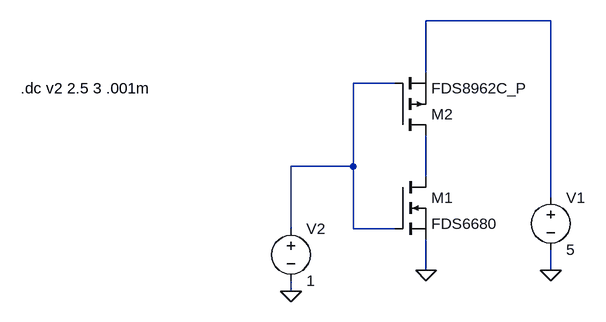
[diagram p0: schematic mos1.asc]
mos1.asc, the LTspice schematic file:
Version 4
SHEET 1 880 680
WIRE 384 -96 192 -96
WIRE 192 -16 192 -96
WIRE 144 0 80 0
WIRE 80 128 80 0
WIRE 80 128 -16 128
WIRE 192 144 192 80
WIRE 384 176 384 -96
WIRE -16 224 -16 128
WIRE 80 224 80 128
WIRE 144 224 80 224
WIRE 192 288 192 240
WIRE 384 288 384 256
WIRE -16 320 -16 304
FLAG 192 288 0
FLAG 384 288 0
FLAG -16 320 0
SYMBOL nmos 144 144 R0
SYMATTR InstName M1
SYMATTR Value FDS6680
SYMBOL voltage 384 160 R0
WINDOW 123 0 0 Left 2
WINDOW 39 0 0 Left 2
SYMATTR InstName V1
SYMATTR Value 5
SYMBOL voltage -16 208 R0
WINDOW 123 0 0 Left 2
WINDOW 39 0 0 Left 2
SYMATTR InstName V2
SYMATTR Value 1
SYMBOL pmos 144 80 M180
SYMATTR InstName M2
SYMATTR Value FDS8962C_P
TEXT -432 8 Left 2 !.dc v2 2.5 3 .001m

The netlist it stands for:
* mos1.asc
M1 N003 N002 0 0 FDS6680
V1 N001 0 5
V2 N002 0 1
M2 N003 N002 N001 N001 FDS8962C_P
.model NMOS NMOS
.model PMOS PMOS
.lib standard.mos
.dc v2 2.5 3 .001m
.backanno
.end